# Altium schematic sheet power_ebox_v3.SchDoc
size A; SheetNumber: 2; SheetTotal: 2
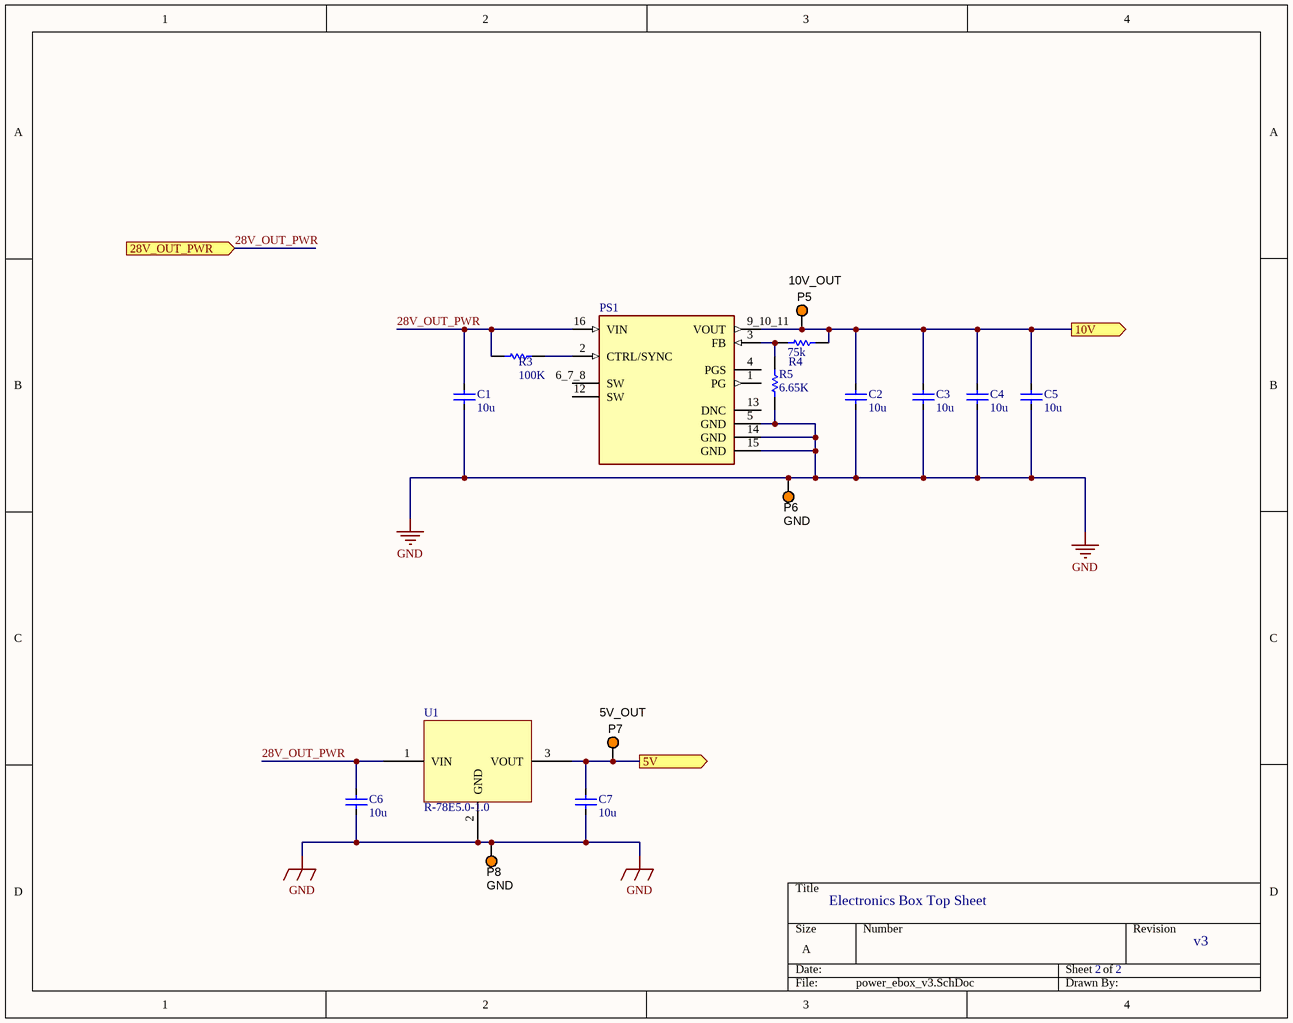
[diagram p0: power_ebox_v3.SchDoc]

## Parts
C1  10u  [10uF Cer SMD]
C2  10u  [10uF Cer SMD]
C3  10u  [10uF Cer SMD]
C4  10u  [10uF Cer SMD]
C5  10u  [10uF Cer SMD]
C6  10u  [10uF Cer SMD]
C7  10u  [10uF Cer SMD]
P5  10V_OUT  [KSTN-5003]
P6  GND  [KSTN-5003]
P7  5V_OUT  [KSTN-5003]
P8  GND  [KSTN-5003]
PS1  *  [10V Step-Down]  (value not drawn)
R3  100K  [General Resistor]
R4  75k  [75K]
R5  6.65K  [6.65K]
U1  R-78E5.0-1.0  [Step-Down Converter]

## Ports
5V (out), 10V (out), 28V_OUT_PWR (in)

## Nets
GND: C1.2 C2.1 C3.1 C4.1 C5.1 C6.1 C7.1 P6.1 P8.1 PS1.5(GND) PS1.14(GND) PS1.15(GND) R5.2 U1.2(GND)
5V: C7.2 P7.1 U1.3(VOUT) ; port 5V
10V: C2.2 C3.2 C4.2 C5.2 P5.1 PS1.9_10_11(VOUT) R4.2 ; port 10V
28V_OUT_PWR: C1.1 C6.2 PS1.16(VIN) R3.2 U1.1(VIN) ; port 28V_OUT_PWR
NetPS1_2: PS1.2(CTRL/SYNC) R3.1
NetPS1_3: PS1.3(FB) R4.1 R5.1

Not connected (* = marked no-connect by the designer): PS1 1(PG) 4(PGS) 6_7_8(SW) 12(SW) 13(DNC)

## Notes on the sheet
- Electronics Box Top Sheet
- 2
- v3

## Library data of the parts
C1-C7 = Capacitor - Ceramic
P5-P8 = CMP-002-00037-2: Test Point, Orange, Height 4.6 mm, Tail Length 3 mm, 1-Pin THD, RoHS; Manufacturer: Keystone; Colour: Orange; Packaging: Bulk; Package Description: 1-Pin Through Hole Device, Dia 2.54 mm; Pins: 1; Package Reference: 5003; Datasheet Version: Jun-15; Case/Package: 5003; Mounting Technology: TH; Connector Type: TestPoint; Diameter: 2.54mm; Contact Material: Bronze; Datasheet URL: http://keyelco.com/userAssets/file/M65p56.pdf; Manufacturer URL: http://www.keyelco.com/; Package Quantity: 10; Contact Plating: Tin; RoHS Compliant: True
PS1 = 10V Step-Down: Non-Isolated DC/DC Converters 4-36Vin 0.8-24Vout 1.5A; MP: RPX-1.5-R; MF: Recom Power; Value: *; Availability: Warning; Package: None; Check_prices: https://www.snapeda.com/parts/RPX-1.5-R/Recom%20Power/view-part/5138341/?ref=eda; Price: None; SnapEDA_Link: https://www.snapeda.com/parts/RPX-1.5-R/Recom%20Power/view-part/5138341/?ref=snap; Purchase-URL: https://pricing.snapeda.com/search/part/RPX-1.5-R/?ref=eda
R3-R5 = Resistor
U1 = Step-down Converter